# EAGLE schematic TALLER1 (EAGLE 7.6.0)
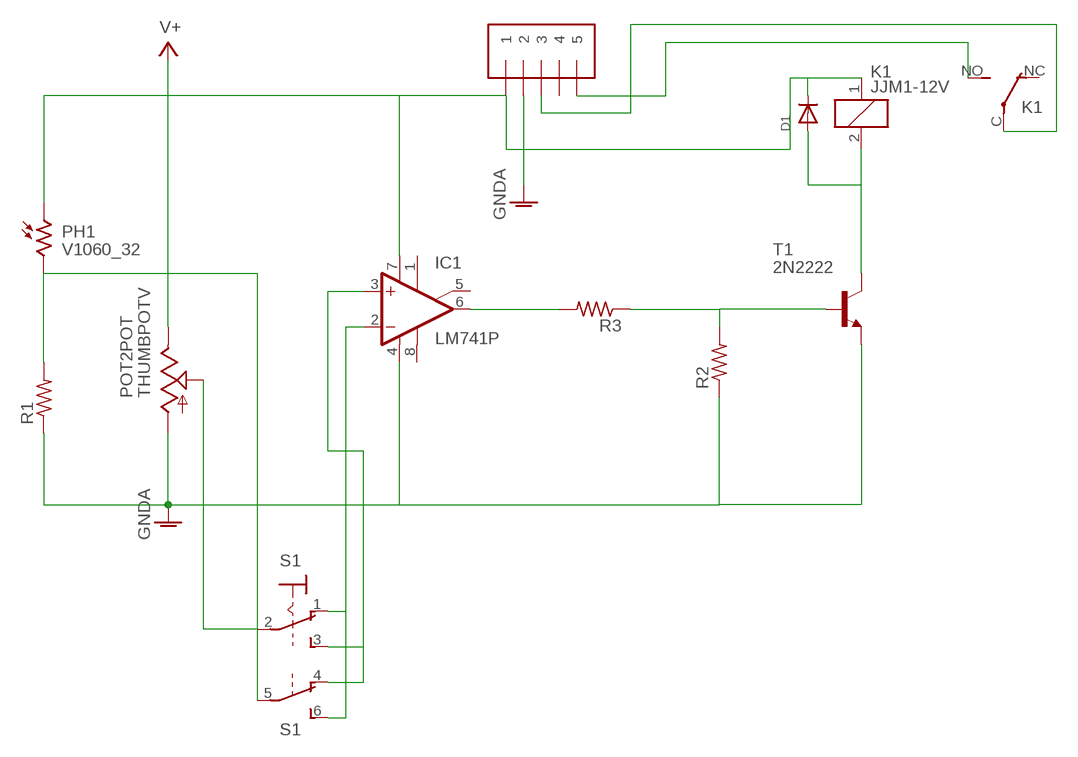
[diagram p0: schematic, sheet 1]

## Parts
D1  DIODEDO-1N4148  [DO-1N4148]
IC1  LM741P  [DIL08]
J2  1X5  [1X05-3.5MM]
K1  JJM1-12V  [JJM1C]
PH1  V1060_32  [TO-5_V10]
POT2  THUMBPOTV  [THUMBWHEELV]
R1  R-US_0207/10  [0207/10]
R2  R-US_0207/10  [0207/10]
R3  R-US_0207/10  [0207/10]
S1  320-938  [320-938]
T1  2N2222  [TO18]

## Nets
GNDA: IC1.4(V-) J2.2 POT2.A(POT:A) R1.1 R2.1 T1.1(E)
N$2: PH1.2 R1.2 S1.5(B:P)
N$4: POT2.S(POT:S) S1.2(1:P)
N$5: IC1.2(-IN) S1.1(1:O) S1.6(B:S)
N$6: IC1.3(+IN) S1.3(1:S) S1.4(B:O)
N$7: IC1.6(OUT) R3.2
N$8: R2.2 R3.1 T1.2(B)
N$9: D1.A K1.2 T1.3(C)
N$12: J2.5 K1.NO(2:S)
N$13: J2.3 K1.C(2:P)
V+: D1.C IC1.7(V+) J2.1 K1.1 PH1.1 POT2.E(POT:E)
Unconnected: IC1.1(ON1) IC1.5(ON2) IC1.8(OPT) J2.4 K1.NC(2:O) POT2.SW1(SW:S) POT2.SW2(SW:P)

## Library data of the parts
D1 = adafruit:DIODE: Diode SMADIODE - SMA Surface Mount Package 20V 1A Schottky Diode Digikey: 641-1014-6-ND DO-1N4148 - Through Hole Small Current Diode SOD-123 20V 1 A (.5mV Vf) Schottky Diode - Digikey: MBRX120TPMSCT-ND SOD-323 10V 570mA (.38mV Vf, 3ns) Schottky Diode - Digikey: ZLLS410CT-ND SOD-523 30V 30mA Schottky Diode (RB751S-40TE61) - Digikey: RB751S-40TE61CT-ND SOT23-R/W - SOT23 Package (R = Solder Paste/Reflow Ovens, W = Hand-Soldering) BAT54Film 40V 300mA - Digikey: 497-7162-1-ND
IC1 = opams:*741: OP AMP
J2 = adafruit:1X5
K1 = relay:JJM1-12V: HALF-SIZE AUTOMOTIVE RELAY NAiS Source: http://www.mew-europe.com/.. en_ds_61210_0001.pdf; MF: AROMAT/ MATSUSHITA; MPN: JJM1-12V; OC_FARNELL: unknown; OC_NEWARK: 10C7318
PH1 = photo-elements:?1060*: Sensor Street Light control Source: http://optoelectronics.perkinelmer.com/content/Datasheets/DTS_PhotocellsB1060.pdf
POT2 = adafruit:THUMBPOT: Thumbwheel pot with switch Available in horizontal (Alpha RV121SF) or vertical (Xicon 311-1701)
R1-R3 = adafruit:R-US_: RESISTOR, American symbol
S1 = switch:320-938: TOGGLE SWITCH distributor RS Components
T1 = transistor-neu-to92:2N2222: NPN TRANSISTOR